# EasyEDA Pro project EDA-Robot_V1.3.epro

# Schematic EDA-Robot插件版(带开关)
Board Name: V1.3; Create Date: 2024-12-31; Page Name: P1; Project Name: EDA-Robot机器狗; Schematic Name: EDA-Robot插件版(带开关); Update Date: 2025-01-21; Company: 嘉立创EDA; Page Size: A4; Version: V1.0
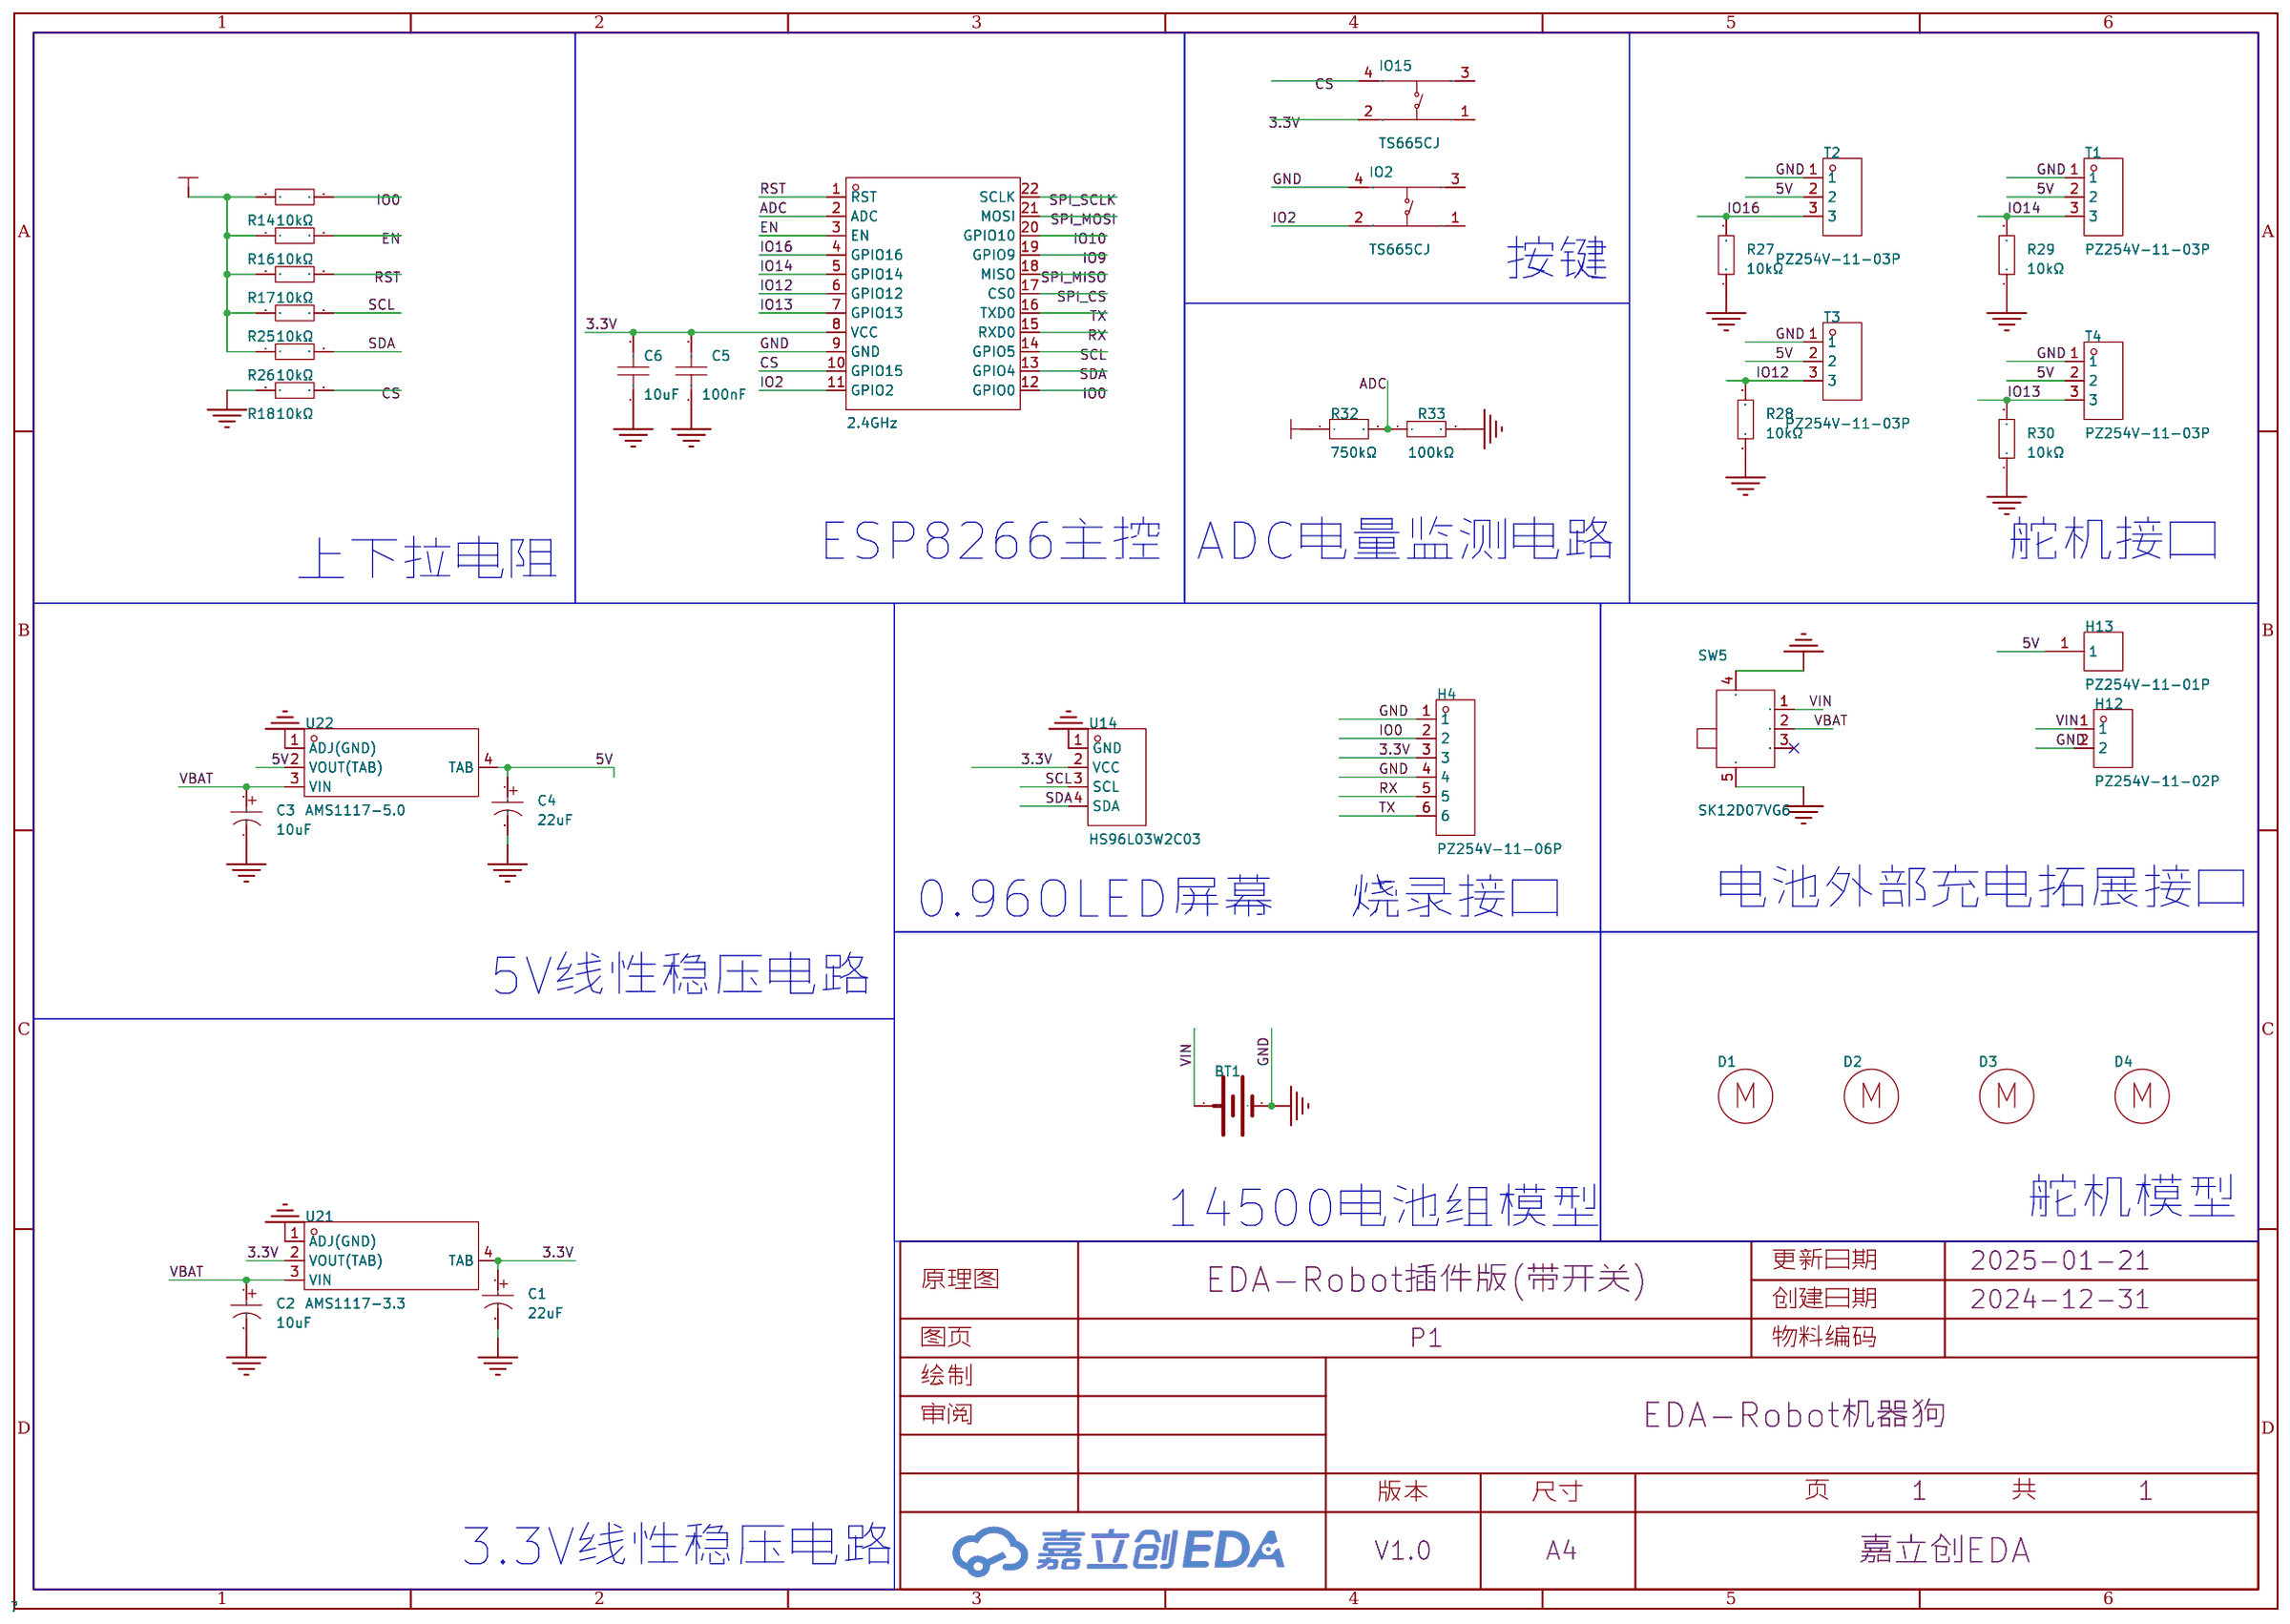
[diagram p0: schematic sheet]

## Parts
BT1  -  [2节串联14500电池盒]
C1  22uF  [CAP-TH_BD4.0-P1.50-D0.8-FD]
C2  10uF  [CAP-TH_BD4.0-P1.50-D0.8-FD]
C3  10uF  [CAP-TH_BD4.0-P1.50-D0.8-FD]
C4  22uF  [CAP-TH_BD4.0-P1.50-D0.8-FD]
C5  100nF  [CAP-TH_L4.2-W3.5-P2.54-D0.5]
C6  10uF  [CAP-TH_L5.5-W3.8-P3.50-D0.6]
D1  -  [舵机]
D2  -  [舵机]
D3  -  [舵机]
D4  -  [舵机]
H4  PZ254V-11-06P  [HDR-TH_6P-P2.54-V-M]
H12  PZ254V-11-02P  [HDR-TH_2P-P2.54-V-M]
H13  PZ254V-11-01P  [HDR-TH_1P-P2.54-V-M]
IO2  TS665CJ  [SW-TH_4P-L6.0-W6.0-P4.50-LS6.5]
IO15  TS665CJ  [SW-TH_4P-L6.0-W6.0-P4.50-LS6.5]
R14  10kΩ  [RES-TH_BD2.4-L6.3-P10.30-D0.6]
R16  10kΩ  [RES-TH_BD2.4-L6.3-P10.30-D0.6]
R17  10kΩ  [RES-TH_BD2.4-L6.3-P10.30-D0.6]
R18  10kΩ  [RES-TH_BD2.4-L6.3-P10.30-D0.6]
R25  10kΩ  [RES-TH_BD2.4-L6.3-P10.30-D0.6]
R26  10kΩ  [RES-TH_BD2.4-L6.3-P10.30-D0.6]
R27  10kΩ  [RES-TH_BD2.4-L6.3-P10.30-D0.6]
R28  10kΩ  [RES-TH_BD2.4-L6.3-P10.30-D0.6]
R29  10kΩ  [RES-TH_BD2.4-L6.3-P10.30-D0.6]
R30  10kΩ  [RES-TH_BD2.4-L6.3-P10.30-D0.6]
R32  750kΩ  [RES-TH_BD2.4-L6.3-P10.30-D0.6]
R33  100kΩ  [RES-TH_BD2.4-L6.3-P10.30-D0.6]
SW5  SK12D07VG6  [SW-TH_SK12D07VG6]
T1  PZ254V-11-03P  [HDR-TH_3P-P2.54-V-M]
T2  PZ254V-11-03P  [HDR-TH_3P-P2.54-V-M]
T3  PZ254V-11-03P  [HDR-TH_3P-P2.54-V-M]
T4  PZ254V-11-03P  [HDR-TH_3P-P2.54-V-M]
U10  2.4GHz  [WIFIM-SMD_ESP-12F-ESP8266MOD]
U14  HS96L03W2C03  [OLED-TH_L27.8-W27.2-P2.54_C9900033791]
U21  AMS1117-3.3  [SOT-223-4_L6.5-W3.5-P2.30-LS7.0-BR]
U22  AMS1117-5.0  [SOT-223_L6.7-W3.5-P2.30-BR]

## Library data of the parts
BT1 = 2节串联14500电池组: 连接器类型:电池底座;适用电池规格:CR1220;触头材质:磷青铜;工作温度范围:-25℃~+85℃;; JLCPCB Part Class: 扩展库
C1 C4 = KS226M025C07RR0VH2FP0: 容值:22uF;精度:±20%;额定电压:25V;纹波电流:-;等效串联电阻:-;; LCSC Part Name: 22uF ±20% 25V; Supplier Part: C43840; Manufacturer: CX(承兴); Supplier Footprint: 插件,D4xL7mm; JLCPCB Part Class: Extended Part; Datasheet: https://atta.szlcsc.com/upload/public/pdf/source/20211027/7B10195EF01EB9374BE8935690E3D906.pdf; Supplier: LCSC; Tolerance: ±20%; Rated Voltage: 25V; Lead Spacing: 1.5mm; φD: 4mm; L: 7mm; Lifetime @ Temp: 1000hrs@105℃; Operating Temperature: -40℃~+105℃
C2 C3 = KS106M025C07RR0VH2FP0: 容值:10uF;精度:±20%;额定电压:25V;纹波电流:29mA@120Hz;等效串联电阻:-;; LCSC Part Name: 10uF ±20% 25V; Supplier Part: C43351; Manufacturer: CX(承兴); Supplier Footprint: 插件,D4xL7mm; JLCPCB Part Class: 扩展库; Datasheet: https://atta.szlcsc.com/upload/public/pdf/source/20211027/7B10195EF01EB9374BE8935690E3D906.pdf; Supplier: LCSC; Tolerance: ±20%; Rated Voltage: 25V; Ripple Current: 29mA@120Hz; Lead Spacing: 1.5mm; φD: 4mm; L: 7mm; Lifetime @ Temp: 1000hrs@105℃; Operating Temperature: -40℃~+105℃
C5 = 178MU0006: 容值:100nF;精度:±10%;额定电压:50V;温度系数:X7R;; LCSC Part Name: 100nF ±10% 50V; Supplier Part: C5632430; Manufacturer: KNSCHA(科尼盛); Supplier Footprint: 插件,P=2.54mm; JLCPCB Part Class: 扩展库; Datasheet: https://atta.szlcsc.com/upload/public/pdf/source/20230506/6B3136079A6D587E863927628E877AC6.pdf; Supplier: LCSC; Tolerance: ±10%; Voltage Rated: 50V; Temperature Coefficient: X7R
C6 = CD1E106MC9BER2F100: 容值:10uF;精度:±20%;额定电压:25V;温度系数:X5R;; LCSC Part Name: 10uF ±20% 25V; Supplier Part: C2761733; Manufacturer: Dersonic(德尔创); Supplier Footprint: 插件,P=5.08mm; JLCPCB Part Class: 扩展库; Datasheet: https://atta.szlcsc.com/upload/public/pdf/source/20210512/C2761733_48A4F8FFA54EF14BEC181E01EC41507A.pdf; Supplier: LCSC; Tolerance: ±20%; Voltage Rated: 25V; Temperature Coefficient: X5R
D1-D4 = SG90舵机(180度版): JLCPCB Part Class: 扩展库
H4 = PZ254V-11-06P: 插针结构:1x6P;间距:2.54mm;行距:-;圆针/方针:方针;安装类型:直插;排数:单排;总PIN位数:6P;额定电流:-;额定电压:-;配合针长度:6mm;塑高:2.5mm;端接针长度:3mm;触头材质:黄铜;触头镀层:-;工作温度范围:-40℃~+105℃;颜色:黑色;; LCSC Part Name: 间距:2.54mm 1x6P 直插 方针; Supplier Part: C492405; Manufacturer: XFCN(兴飞); Supplier Footprint: 插件,P=2.54mm; JLCPCB Part Class: 扩展库; Datasheet: https://atta.szlcsc.com/upload/public/pdf/source/20200309/C492405_597F1930F5B55CC3C7FD95458F1C3977.pdf; Supplier: LCSC; Pin Structure: 1x6P; Pitch: 2.54mm; Circluar Pins/Square Pins: 方针; Mounting Type: 直插; Number of Rows: 单排; Number of Pins: 6P; Length of Mating Pin: 6mm; Insulation Height: 2.5mm; Length of End Connection Pin: 3mm; Contact Material: 黄铜; Operating Temperature Range: -40℃~+105℃; Color: 黑色
H12 = PZ254V-11-02P: 插针结构:1x2P;间距:2.54mm;行距:-;圆针/方针:方针;安装类型:直插;排数:单排;总PIN位数:2P;额定电流:-;额定电压:-;配合针长度:6mm;塑高:2.5mm;端接针长度:3mm;触头材质:黄铜;触头镀层:-;工作温度范围:-40℃~+105℃;颜色:黑色;; LCSC Part Name: 间距:2.54mm 1x2P 直插 方针; Supplier Part: C492401; Manufacturer: XFCN(兴飞); Supplier Footprint: 插件,P=2.54mm; JLCPCB Part Class: 扩展库; Datasheet: https://atta.szlcsc.com/upload/public/pdf/source/20200309/C492401_A812433581A9B211A7FFA413ADDFF0E5.pdf; Supplier: LCSC; Pin Structure: 1x2P; Pitch: 2.54mm; Circluar Pins/Square Pins: 方针; Mounting Type: 直插; Number of Rows: 单排; Number of Pins: 2P; Length of Mating Pin: 6mm; Insulation Height: 2.5mm; Length of End Connection Pin: 3mm; Contact Material: 黄铜; Operating Temperature Range: -40℃~+105℃; Color: 黑色
H13 = PZ254V-11-01P: 插针结构:1x1P;间距:2.54mm;行距:-;圆针/方针:方针;安装类型:直插;排数:单排;总PIN位数:1P;额定电流:-;额定电压:-;配合针长度:6mm;塑高:2.5mm;端接针长度:3mm;触头材质:黄铜;触头镀层:-;工作温度范围:-40℃~+105℃;颜色:黑色;; LCSC Part Name: 间距:2.54mm 1x1P 直插 方针; Supplier Part: C492400; Manufacturer: XFCN(兴飞); Supplier Footprint: 插件,P=2.54mm; JLCPCB Part Class: 扩展库; Datasheet: https://atta.szlcsc.com/upload/public/pdf/source/20200309/C492400_46876A5B545F5AE6B8D4A09C46E276E8.pdf; Supplier: LCSC; Pin Structure: 1x1P; Pitch: 2.54mm; Circluar Pins/Square Pins: 方针; Mounting Type: 直插; Number of Rows: 单排; Number of Pins: 1P; Length of Mating Pin: 6mm; Insulation Height: 2.5mm; Length of End Connection Pin: 3mm; Contact Material: 黄铜; Operating Temperature Range: -40℃~+105℃; Color: 黑色
IO2 IO15 = TS665CJ: 电路结构:单刀单掷;按钮形状:圆形按钮;安装方式:直插;开关长度:6mm;开关宽度:6mm;开关高度:5mm;触点电流:50mA;额定电压(DC):12V;带灯:-;机械寿命:-;; LCSC Part Name: 6*6*5mm 直插 轻触开关; Supplier Part: C393938; Manufacturer: SHOU HAN(首韩); Supplier Footprint: 插件; JLCPCB Part Class: 扩展库; Datasheet: https://atta.szlcsc.com/upload/public/pdf/source/20190521/C393938_BDABEAC600B4C55E200A80AA129B70BC.pdf; Supplier: LCSC; Circuit: 单刀单掷; Actuator Style: 圆形按钮; Mounting Style: 直插; Switch Length: 6mm; Switch Width: 6mm; Switch Height: 5mm; Contact Current: 50mA; Voltage Rating (DC): 12V
R14 R16-R18 R25-R30 = RN1/4W10KFT/BA1: 电阻类型:金属膜电阻;阻值:10kΩ;精度:±1%;功率:250mW;温度系数:±50ppm/℃;; LCSC Part Name: 10kΩ ±1% 250mW 金属膜电阻; Supplier Part: C410695; Manufacturer: Tyohm(幸亚电阻); Supplier Footprint: 插件,D2.4xL6.5mm; JLCPCB Part Class: Extended Part; Datasheet: https://atta.szlcsc.com/upload/public/pdf/source/20190808/C410699_D126E64D28B638F1D73B58E9F61DFD9B.pdf; Supplier: LCSC; Type: 金属膜电阻; Tolerance: ±1%; Overload Voltage (Max): 250V; Power(Watts): 250mW; Temperature Coefficient: ±50ppm/℃; Operating Temperature Range: -55℃~+125℃
R32 = MFR-25FTE52-750K: 电阻类型:金属膜电阻;阻值:750kΩ;精度:±1%;功率:250mW;温度系数:±50ppm/℃;; LCSC Part Name: 金属膜电阻 750kΩ ±1% 250mW; Supplier Part: C173043; Manufacturer: YAGEO(国巨); Supplier Footprint: 插件,D2.4xL6.3mm; JLCPCB Part Class: Extended Part; Datasheet: https://atta.szlcsc.com/upload/public/pdf/source/20191118/C457825_18355E864DE4965678DC27B0EBC3E21E.pdf; Supplier: LCSC; Type: 金属膜电阻; Tolerance: ±1%; Power(Watts): 250mW; Temperature Coefficient: ±50ppm/℃; Operating Temperature Range: -55℃~+155℃
R33 = MFR50SFTE52-100K: 电阻类型:金属膜电阻;阻值:100kΩ;精度:±1%;功率:500mW;温度系数:±50ppm/℃;; LCSC Part Name: 金属膜电阻 100kΩ ±1% 500mW; Supplier Part: C173137; Manufacturer: YAGEO(国巨); Supplier Footprint: 插件,D2.4xL6.3mm; JLCPCB Part Class: Extended Part; Datasheet: https://atta.szlcsc.com/upload/public/pdf/source/20191118/C457825_18355E864DE4965678DC27B0EBC3E21E.pdf; Supplier: LCSC; Type: 金属膜电阻; Tolerance: ±1%; Power(Watts): 500mW; Temperature Coefficient: ±50ppm/℃; Operating Temperature Range: -55℃~+155℃
SW5 = SK12D07VG6: 电路结构:单刀双掷;安装方式:-;开关颜色:-;额定电流(DC):500mA;额定电压(DC):50V;额定电流(AC):-;额定电压(AC):-;机械寿命:5千次;; LCSC Part Name: 3脚2两档位SK12D07VG6 1P2T卧式拨动开关,柄长6MM; Supplier Part: C2681575; Manufacturer: SHOU HAN(首韩); Supplier Footprint: 插件; JLCPCB Part Class: 扩展库; Datasheet: https://atta.szlcsc.com/upload/public/pdf/source/20210224/C2681575_3012D31310882582C75C81102188B09E.pdf; Supplier: LCSC; Circuit: 单刀双掷; Pin Style: PC引脚; Switch Length: 8.7mm; Switch Width: 4.4mm; Switch Height: 4.7mm; Current Rating (DC): 500mA; Voltage Rating (DC): 50V; Mechanical Life: 5千次; Operating Temperature: -10℃~+50℃
T1-T4 = PZ254V-11-03P: 插针结构:1x3P;间距:2.54mm;行距:-;圆针/方针:方针;安装类型:直插;排数:单排;总PIN位数:3P;额定电流:3A;额定电压:250V;配合针长度:6mm;塑高:2.5mm;端接针长度:3mm;工作温度范围:-40℃~+105℃;颜色:黑色;; LCSC Part Name: 间距:2.54mm 1x3P 直插 方针; Supplier Part: C2937625; Manufacturer: XFCN(兴飞); Supplier Footprint: 插件,P=2.54mm; JLCPCB Part Class: 扩展库; Datasheet: https://atta.szlcsc.com/upload/public/pdf/source/20200309/C492402_8335C3D49C4E4C618838D59BB1D024C1.pdf; Supplier: LCSC; Pin Structure: 1x3P; Pitch: 2.54mm; Circluar Pins/Square Pins: 方针; Mounting Type: 直插; Number of Rows: 单排; Number of Pins: 3P; Current Rating (Max): 3A; Voltage Rating (Max): 250V; Length of Mating Pin: 6mm; Insulation Height: 2.5mm; Length of End Connection Pin: 3mm; Operating Temperature Range: -40℃~+105℃; Color: 黑色
U10 = ESP-12F(ESP8266MOD): 频率:2.4GHz;发射功率:16dBm;核心处理器:ESP8266;天线形式:PCB 板载天线;接收灵敏度:-90dBm;; LCSC Part Name: 完整的802.11b/g/n Wi-Fi的SoC模块; Supplier Part: C82891; Manufacturer: Ai-Thinker(安信可); Supplier Footprint: SMD,16x24mm; JLCPCB Part Class: Extended Part; Datasheet: https://atta.szlcsc.com/upload/public/pdf/source/20210219/C82891_ABD84A460F4F056A2757267CCCA4B508.pdf; Supplier: LCSC; Output Power: 16dBm; Core Processor: ESP8266; Support Interface: GPIO；UART；I2C；PWM；SPI；ADC; Antenna Type: PCB 板载天线; Wireless Standard: 802.11b/g/n; Operating Voltage: 3.3V; Receive  Current: 120mA; Send  Current: 170mA; Sensitivity: -90dBm; Operating Temperature: -40℃~+85℃
U14 = HS96L03W2C03: 主控芯片:SSD1315;接口类型:I2C;尺寸(inch):0.96;像素分辨率:128x64;; LCSC Part Name: 0.96寸OLED显示屏窄白光IIC; Supplier Part: C5248080; Manufacturer: HS(汉昇); JLCPCB Part Class: 扩展库; Datasheet: https://atta.szlcsc.com/upload/public/pdf/source/20230627/763D01F79A90007632F098068C7C8AD9.pdf; Supplier: LCSC; Main Control Chip: SSD1315; Interface Type: I2C; Size: 0.96; Pixel Resolution: 128x64; Operating Temperature: -40℃~+70℃
U21 = AMS1117-3.3_C347222: 输出类型:固定;最大输入电压:18V;输出电压:3.3V;输出电流:1A;电源纹波抑制比(PSRR):60dB@(120Hz);输出极性:正极;; LCSC Part Name: 输出:3.3V 电流:1A 耐压:12V; Supplier Part: C347222; Manufacturer: UMW(友台半导体); Supplier Footprint: SOT-223; JLCPCB Part Class: 扩展库; Datasheet: https://atta.szlcsc.com/upload/public/pdf/source/20231109/155D79A26D9DB04352555A58D5969DC8.pdf; Supplier: LCSC; Output Type: 固定; Maximum Input Voltage: 18V; Output Voltage: 3.3V; Output Current: 1A; Power Supply Rejection Ratio (PSRR): 60dB@(120Hz); Dropout Voltage: 1.3V@(1A); Feature: 过流保护(OCP); Output Polarity: 正极; Number of Outputs: 1
U22 = AMS1117-5.0_C347223: 输出类型:固定;最大输入电压:12V;输出电压:5V;最大输出电流:1A;电源纹波抑制比(PSRR):60dB@(120Hz);输出极性:正极;; LCSC Part Name: 输出:5V 电流:1A 耐压:12V; Supplier Part: C347223; Manufacturer: UMW(友台半导体); Supplier Footprint: SOT-223; JLCPCB Part Class: 扩展库; Datasheet: https://atta.szlcsc.com/upload/public/pdf/source/20231109/155D79A26D9DB04352555A58D5969DC8.pdf; Supplier: LCSC; Output Type: 固定; Maximum Input Voltage: 12V; Output Voltage: 5V; MAX Output Current: 1A; Power Supply Rejection Ratio (PSRR): 60dB@(120Hz); Dropout Voltage: 1.3V@(1A); Output Polarity: 正极; Number of Outputs: 1

## Nets
3.3V: C1.1 C5.2 C6.2 H4.3 IO15.2(B) R14.1 R16.1 R17.1 R25.1 R26.1 U10.8(VCC) U14.2(VCC) U21.2(VOUT(TAB)) U21.4(TAB)
5V: C4.1 H13.1 T1.2 T2.2 T3.2 T4.2 U22.2(VOUT(TAB)) U22.4(TAB)
GND: BT1.2(-) C1.2 C2.2 C3.2 C4.2 C5.1 C6.1 H4.1 H4.4 H12.2 IO2.4(D) R18.1 R27.1 R28.1 R29.1 R30.1 R33.2 SW5.4 SW5.5 T1.1 T2.1 T3.1 T4.1 U10.9(GND) U14.1(GND) U21.1(ADJ(GND)) U22.1(ADJ(GND))
VBAT: C2.1 C3.1 R32.1 SW5.2 U21.3(VIN) U22.3(VIN)
VIN: BT1.1(+) H12.1 SW5.1
ADC: R32.2 R33.1 U10.2(ADC)
CS: IO15.4(D) R18.2 U10.10(GPIO15)
EN: R16.2 U10.3(EN)
IO0: H4.2 R14.2 U10.12(GPIO0)
IO2: IO2.2(B) U10.11(GPIO2)
IO9: U10.19(GPIO9)
IO10: U10.20(GPIO10)
IO12: R28.2 T3.3 U10.6(GPIO12)
IO13: R30.2 T4.3 U10.7(GPIO13)
IO14: R29.2 T1.3 U10.5(GPIO14)
IO16: R27.2 T2.3 U10.4(GPIO16)
RST: R17.2 U10.1(RST)
RX: H4.5 U10.15(RXD0)
SCL: R25.2 U10.14(GPIO5) U14.3(SCL)
SDA: R26.2 U10.13(GPIO4) U14.4(SDA)
SPI_CS: U10.17(CS0)
SPI_MISO: U10.18(MISO)
SPI_MOSI: U10.21(MOSI)
SPI_SCLK: U10.22(SCLK)
TX: H4.6 U10.16(TXD0)

Not connected (* = marked no-connect by the designer): IO2 1(A) 3(C); IO15 1(A) 3(C); SW5 3*

## Notes on the sheet
- 按键
- ESP8266主控
- ADC电量监测电路
- 舵机接口
- 上下拉电阻
- 电池外部充电拓展接口
- 0.96OLED屏幕
- 烧录接口
- 5V线性稳压电路
- 14500电池组模型
- 舵机模型
- 3.3V线性稳压电路

# Board PCB2_1
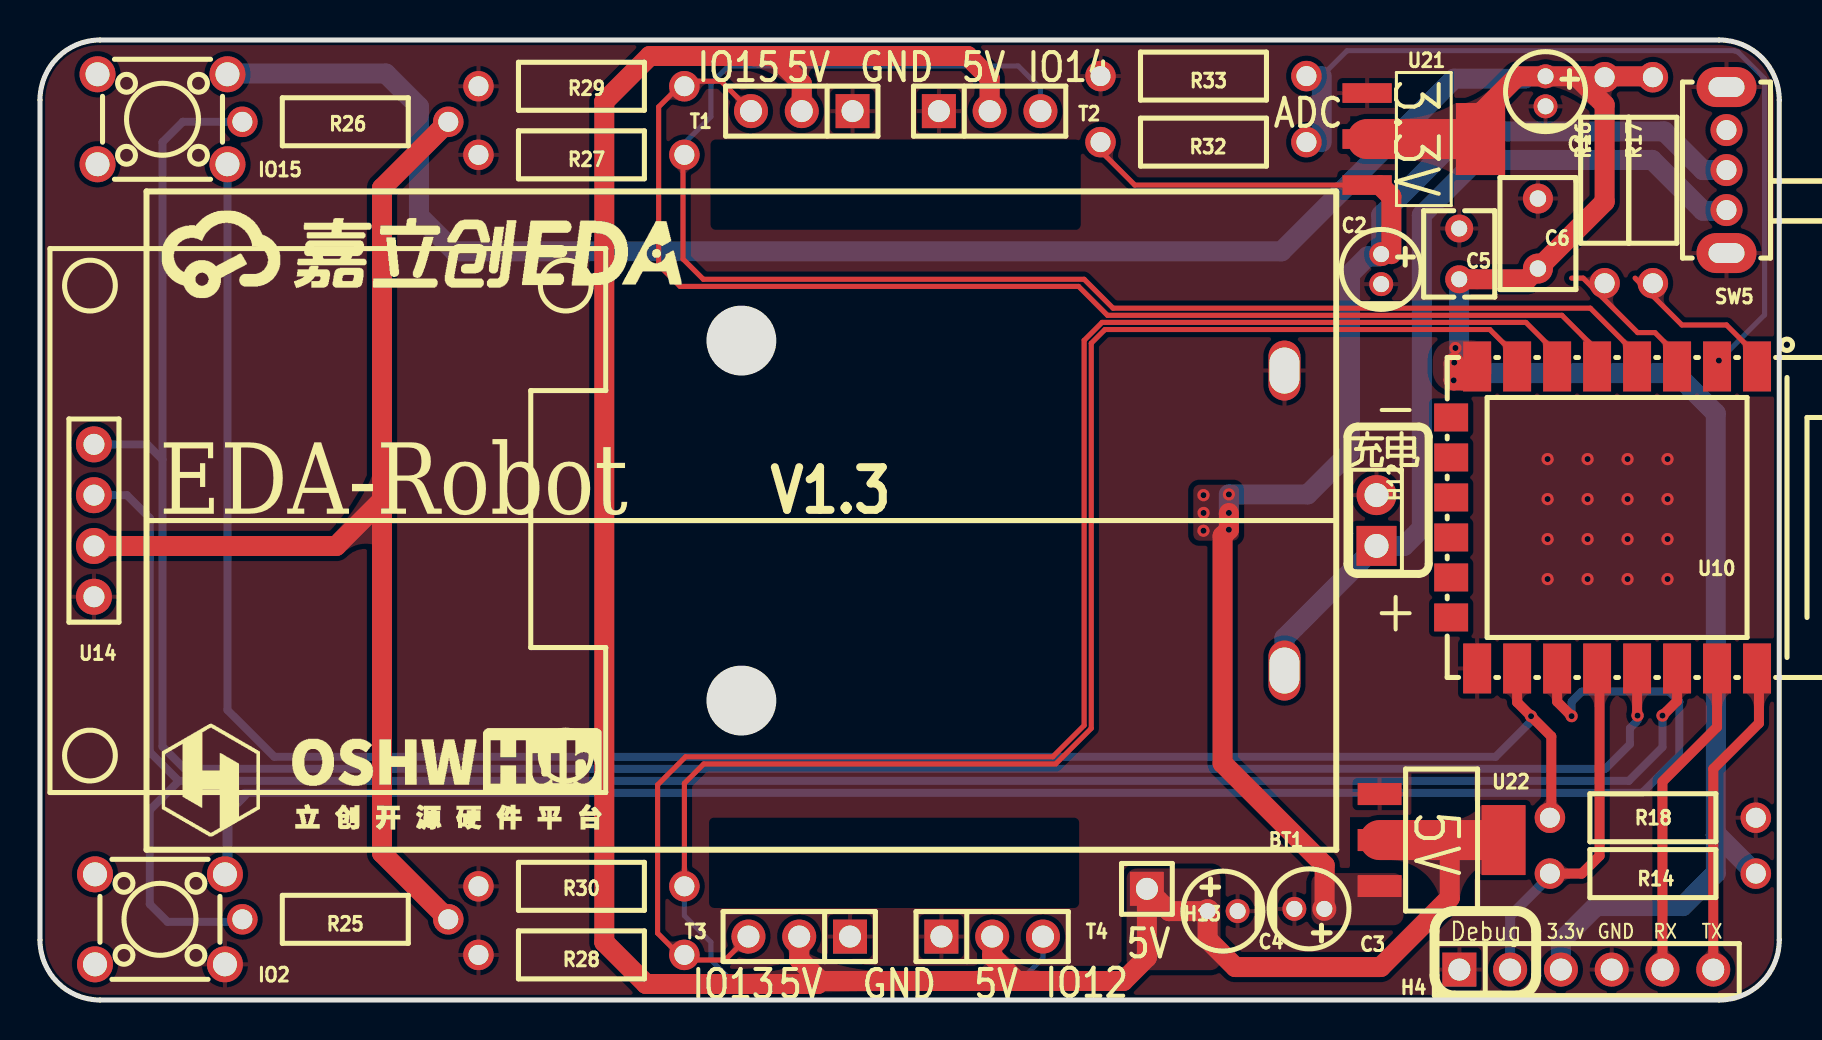
[diagram p1: board, top side]
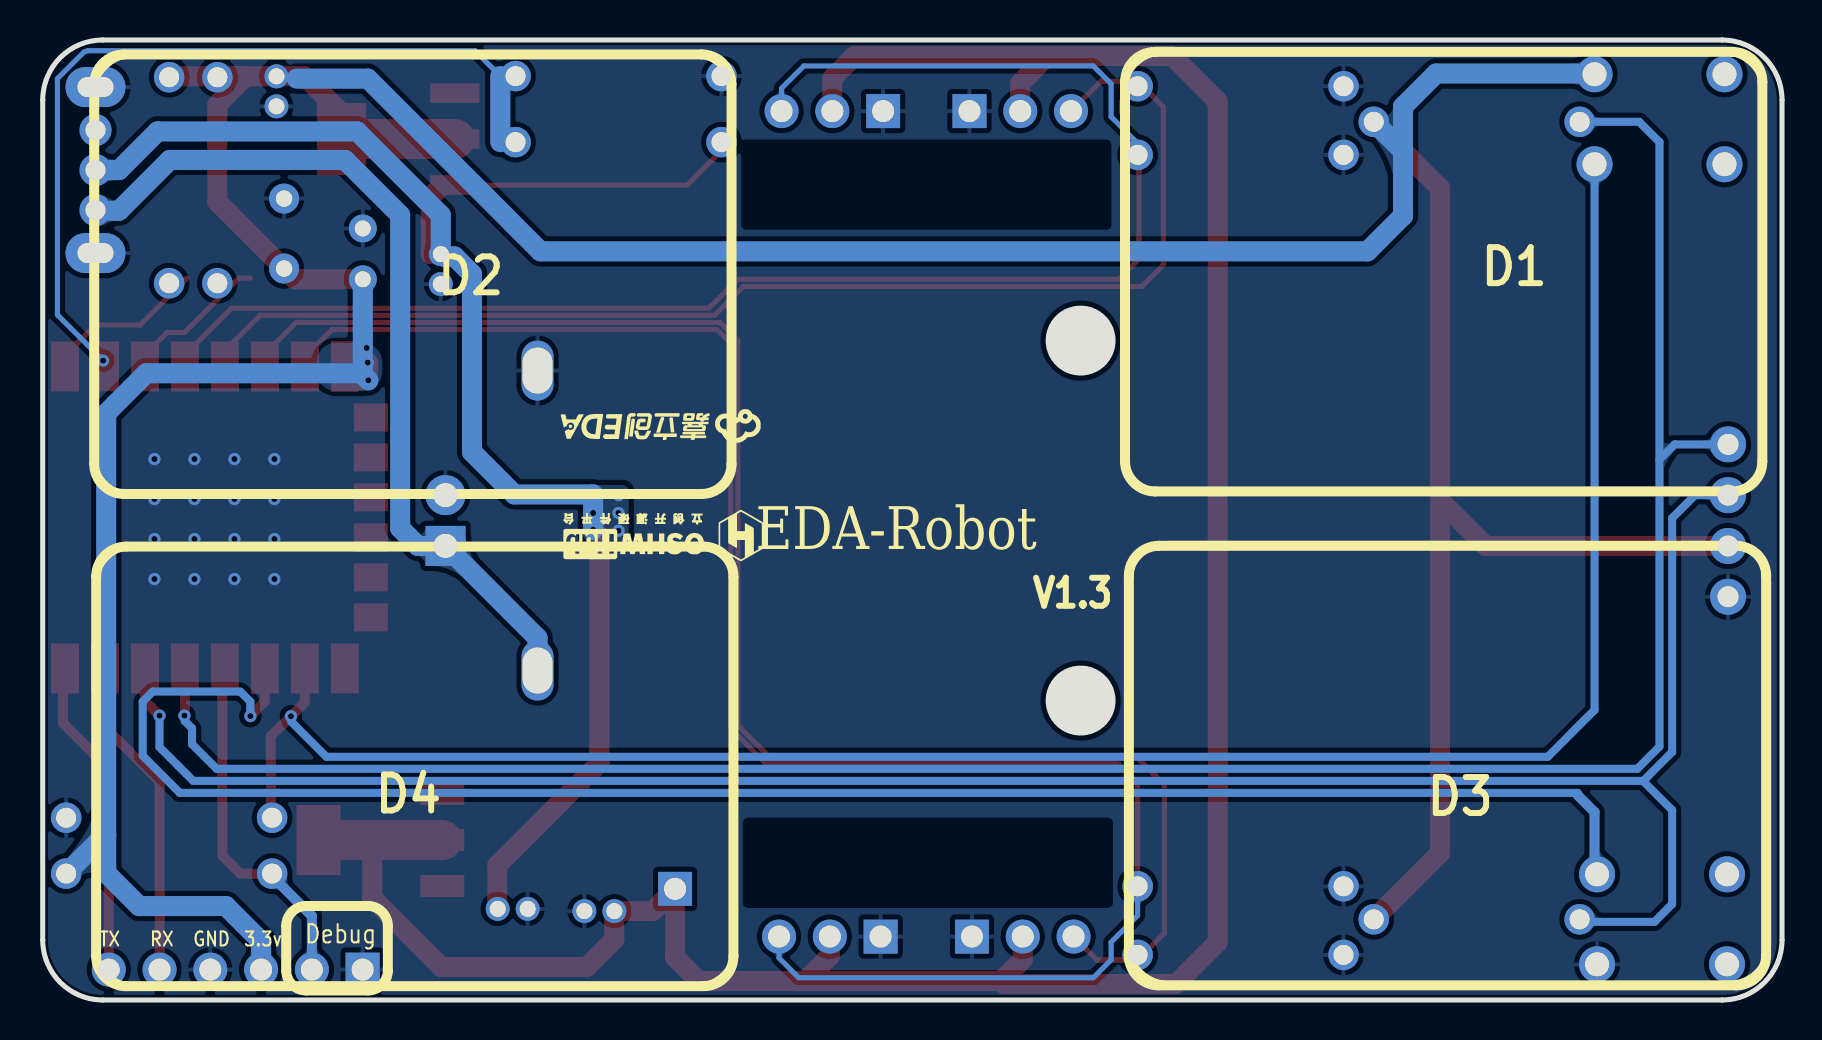
[diagram p2: board, bottom side, seen from below]

Outline 87 x 48 mm; copper layers: Top Layer, Bottom Layer. Coordinates in mm from the lower left corner of the outline.
Outline path: 0,45 0,3 arc(0.88,0.88) 3,0 84,0 arc(86.12,0.88) 87,3 87,45 arc(86.12,47.12) 84,48 3,48 arc(0.88,47.12) 0,45
Stack: Top Layer 0.035mm / Dielectric1 1.51mm FR4 er 4.5 / Bottom Layer 0.035mm

## Design rules (mm)
template: JLCPCB Capability(Two Layers Board)
spacing copperThickness1oz (default): track to track 0.102, other pairs 0.152 to 0.3
spacing copperThickness2oz: track to track 0.203, other pairs 0.152 to 0.3
track width copperThickness1oz (default): min 0.127, default 0.254, max 2.54
track width copperThickness2oz: min 0.203, default 0.254, max 2.54
differential pair differentialPair (default): width min 0.127, default 0.254, max 2.54; gap min 0.152, default 0.152
via viaSize (default): diameter min 0.5, default 0.61, max 10; hole min 0.3, default 0.305, max 6.3

## Placement (name value [footprint] x y rotation side)
BT1  -  [2节串联14500电池盒]  35.08 23.97 180 top
C1  22uF  [CAP-TH_BD4.0-P1.50-D0.8-FD]  75.31 45.44 270 top
C2  10uF  [CAP-TH_BD4.0-P1.50-D0.8-FD]  67.09 36.55 270 top
C3  10uF  [CAP-TH_BD4.0-P1.50-D0.8-FD]  63.49 4.56 180 top
C4  22uF  [CAP-TH_BD4.0-P1.50-D0.8-FD]  59.16 4.44 0 top
C5  100nF  [CAP-TH_L4.2-W3.5-P2.54-D0.5]  70.99 37.31 270 top
C6  10uF  [CAP-TH_L5.5-W3.8-P3.50-D0.6]  74.93 38.32 270 top
D1  -  [舵机]  0.79 47.47 0 bottom
D2  -  [舵机]  52.32 47.34 0 bottom
D3  -  [舵机]  32.8 0.73 180 bottom
D4  -  [舵机]  84.49 0.6 180 bottom
H4  PZ254V-11-06P  [HDR-TH_6P-P2.54-V-M]  77.35 1.52 0 top
H12  PZ254V-11-02P  [HDR-TH_2P-P2.54-V-M]  66.85 23.98 90 top
H13  PZ254V-11-01P  [HDR-TH_1P-P2.54-V-M]  55.37 5.56 0 top
IO2  TS665CJ  [SW-TH_4P-L6.0-W6.0-P4.50-LS6.5]  6 4.03 0 top
IO15  TS665CJ  [SW-TH_4P-L6.0-W6.0-P4.50-LS6.5]  6.13 44.04 0 top
R14  10kΩ  [RES-TH_BD2.4-L6.3-P10.30-D0.6]  80.68 6.32 180 top
R16  10kΩ  [RES-TH_BD2.4-L6.3-P10.30-D0.6]  78.26 40.99 270 top
R17  10kΩ  [RES-TH_BD2.4-L6.3-P10.30-D0.6]  80.68 40.99 270 top
R18  10kΩ  [RES-TH_BD2.4-L6.3-P10.30-D0.6]  80.68 9.11 180 top
R25  10kΩ  [RES-TH_BD2.4-L6.3-P10.30-D0.6]  15.27 4.03 180 top
R26  10kΩ  [RES-TH_BD2.4-L6.3-P10.30-D0.6]  15.27 43.91 180 top
R27  10kΩ  [RES-TH_BD2.4-L6.3-P10.30-D0.6]  27.08 42.26 0 top
R28  10kΩ  [RES-TH_BD2.4-L6.3-P10.30-D0.6]  27.08 2.26 0 top
R29  10kΩ  [RES-TH_BD2.4-L6.3-P10.30-D0.6]  27.08 45.69 0 top
R30  10kΩ  [RES-TH_BD2.4-L6.3-P10.30-D0.6]  27.08 5.69 0 top
R32  750kΩ  [RES-TH_BD2.4-L6.3-P10.30-D0.6]  58.2 42.9 0 top
R33  100kΩ  [RES-TH_BD2.4-L6.3-P10.30-D0.6]  58.2 46.2 180 top
SW5  SK12D07VG6  [SW-TH_SK12D07VG6]  84.36 41.5 90 top
T1  PZ254V-11-03P  [HDR-TH_3P-P2.54-V-M]  38.11 44.45 180 top
T2  PZ254V-11-03P  [HDR-TH_3P-P2.54-V-M]  47.5 44.45 0 top
T3  PZ254V-11-03P  [HDR-TH_3P-P2.54-V-M]  37.98 3.17 180 top
T4  PZ254V-11-03P  [HDR-TH_3P-P2.54-V-M]  47.63 3.17 0 top
U10  2.4GHz  [WIFIM-SMD_ESP-12F-ESP8266MOD]  78.24 24.13 180 top
U14  HS96L03W2C03  [OLED-TH_L27.8-W27.2-P2.54_C9900033791]  2.7 23.97 90 top
U21  AMS1117-3.3  [SOT-223-4_L6.5-W3.5-P2.30-LS7.0-BR]  69.22 43.05 180 top
U22  AMS1117-5.0  [SOT-223_L6.7-W3.5-P2.30-BR]  70.11 8 180 top

## Footprints (pads in the part's own frame, mm; a bottom-side part is the same pattern mirrored in y, then rotated)
2节串联14500电池盒
  oval 1.6x3 hole 1.5x2.3: 1(-27.165,7.5) 2(-27.165,-7.5)
CAP-TH_BD4.0-P1.50-D0.8-FD
  round 1.2 hole 0.8: 1(-0.75,0) 2(0.75,0)
CAP-TH_L4.2-W3.5-P2.54-D0.5
  round 1.4 hole 0.8: 1(-1.27,0) 2(1.27,0)
CAP-TH_L5.5-W3.8-P3.50-D0.6
  round 1.5 hole 0.82: 1(-1.75,0) 2(1.75,0)
HDR-TH_1P-P2.54-V-M
  rect 1.7x1.7 hole 1.1: 1(0,0)
HDR-TH_2P-P2.54-V-M
  rect 2x2 hole 1.2: 1(-1.27,0)
  round 2 hole 1.2: 2(1.27,0)
HDR-TH_3P-P2.54-V-M
  rect 1.7x1.7 hole 1.1: 1(-2.54,0)
  round 1.7 hole 1.1: 2(0,0) 3(2.54,0)
HDR-TH_6P-P2.54-V-M
  rect 1.7x1.7 hole 1.1: 1(-6.35,0)
  round 1.7 hole 1.1: 2(-3.81,0) 3(-1.27,0) 4(1.27,0) 5(3.81,0) 6(6.35,0)
OLED-TH_L27.8-W27.2-P2.54_C9900033791
  round 1.8 hole 1.05: 1(-3.81,0) 2(-1.27,0) 3(1.27,0) 4(3.81,0)
RES-TH_BD2.4-L6.3-P10.30-D0.6
  round 1.524 hole 1: 1(-5.15,0) 2(5.15,0)
SOT-223-4_L6.5-W3.5-P2.30-LS7.0-BR
  rect 2.47x0.98 smd: 1(2.835,-2.3) 2(2.835,0) 3(2.835,2.3)
  rect 2.47x3.6 smd: 4(-2.835,0)
SOT-223_L6.7-W3.5-P2.30-BR
  rect 2.2x1.1 smd: 1(3.099,-2.3) 2(3.099,0) 3(3.099,2.3)
  rect 2.2x3.5 smd: 4(-3.099,0)
SW-TH_4P-L6.0-W6.0-P4.50-LS6.5
  round 1.8 hole 1.2: 1(-3.25,2.25) 2(3.25,2.25) 3(-3.25,-2.25) 4(3.25,-2.25)
SW-TH_SK12D07VG6
  oval 1.6x1.6 hole 1: 1(-2,0) 2(0,0) 3(2,0)
  oval 2x3 hole 1x1.8: 4(4.15,0) 5(-4.15,0)
WIFIM-SMD_ESP-12F-ESP8266MOD
  rect 1.4x2.5 smd: 1(-7.651,-7.551) 2(-5.651,-7.551) 3(-3.651,-7.551) 4(-1.651,-7.551) 5(0.349,-7.551) 6(2.349,-7.551) 7(4.349,-7.551) 8(6.349,-7.551) 9(6.349,7.548) 10(4.349,7.55) 11(2.349,7.551) 12(0.349,7.551) 13(-1.651,7.55) 14(-3.651,7.551) 15(-5.651,7.551) 16(-7.651,7.551)
  rect 1.7x1.4 smd: 17(7.651,-5) 18(7.649,-3.002) 19(7.649,-1.004) 20(7.649,0.998) 21(7.649,2.997) 22(7.651,4.997)

## Nets
As in the schematic.

Pads without a net: IO2 1 3; IO15 1 3; SW5 3

## Via types
v1: diameter 0.61, hole 0.305, Top Layer to Bottom Layer, 30 vias

## Routing (per net, layer and track width the routed paths; a pad name or vN(x,y) marks a point on that pad's centre or on a via; arc(x,y) is an arc through that point)
3.3V: length 225.2
  Top Layer w1: 76.84,46.19 77.23,46.19 ; 76.84,46.19 C1.1 73.89,46.19 72.17,44.46 72.17,43.17 U21.4 ; 76.84,46.19 78.26,44.77 78.26,39.91 C6.2 74.39,36.04 C5.2 ; 77.23,46.19 77.34,46.07 ; 77.23,46.19 80.63,46.19 R17.1 ; 17.11,24.99 17.11,40.6 R26.1 ; 17.11,24.99 17.11,7.35 R25.1 ; 17.11,24.99 14.82,22.7 U14.2 ; v1(70.74,31.87) 70.71,31.84 v1(70.71,30.98) 71.2,30.98 71.89,31.68
  Top Layer w2: 66.39,43.05 U21.4
  Bottom Layer w1: H4.3 76.08,2.94 77.84,4.7 82.17,4.7 83.83,6.35 83.83,8.24 ; 74.29,46.07 70.74,46.07 62.1,37.44 20.73,37.44 18.96,39.21 18.96,42.44 ; C5.2 70.99,31.47 ; 83.83,8.24 83.83,29.33 81.82,31.34 71.07,31.34 v1(70.71,30.98) ; 83.83,8.24 83.91,8.24 85.83,6.32 85.83,6.24 ; 18.96,42.44 R26.1 ; 18.96,42.44 18.96,44.67 17.3,46.33 9.47,46.33 9.38,46.42
  vias: v1(70.8,32.6)
5V: length 133.2
  Top Layer w1: T1.2 38.11,45.83 36.74,47.2 ; 39.06,0.95 38.91,0.8 30.32,0.8 28.23,2.89 28.23,44.93 30.5,47.2 36.74,47.2 ; 39.06,0.95 37.98,2.03 T3.2 ; 39.06,0.95 48.87,0.95 ; 36.74,47.2 46.4,47.2 47.5,46.1 T2.2 ; 70.52,8 70.52,5.11 67.06,1.65 59.79,1.65 58.41,3.03 C4.1 56.48,4.44 H13.1 55.37,2.13 54.19,0.95 48.87,0.95 ; 48.87,0.95 47.63,2.19 T4.2
  Top Layer w2: U22.2 U22.4
GND:
  vias: v1(75.41,27.05) v1(75.41,25.05) v1(75.41,23.05) v1(75.41,21.05) v1(77.41,27.05) v1(77.41,25.05) v1(77.41,23.05) v1(77.41,21.05) v1(79.41,27.05) v1(79.41,25.05) v1(79.41,23.05) v1(79.41,21.05) v1(81.41,27.05) v1(81.41,25.05) v1(81.41,23.05) v1(81.41,21.05)
VBAT: length 82.2
  Top Layer w0.254: 67.02,40.75 54.76,40.75 53.05,42.46 R32.1
  Top Layer w1: 67.6,37.3 67.6,40.17 67.02,40.75 ; v1(59.47,24.35) v1(59.47,23.52) 59.16,23.2 59.16,11.84 64.26,6.74 64.26,4.57 C3.1
  Bottom Layer w1: SW5.2 83.18,41.5 81.25,43.43 71.27,43.43 67.09,39.25 C2.1 66.97,37.18 66.41,37.18 65.53,36.3 65.53,27.4 63.41,25.28 v1(59.47,25.28) v1(59.47,24.35) v1(59.47,23.52)
  vias: v1(58.2,25.24) v1(58.2,24.35) v1(58.2,23.47)
VIN: length 43.8
  Bottom Layer w1: 84.33,39.47 83.18,39.47 80.64,42.01 71.88,42.01 69.12,39.25 69.12,23.59 68.23,22.7 66.86,22.7 H12.1 62.25,18.1 BT1.1
ADC: length 41.6
  Bottom Layer w0.254: 64.11,46.2 65.38,47.47 84.74,47.47 arc(84.84,47.44) 84.94,47.4 86.27,46.07 86.27,34.26 v1(83.98,31.97)
  Bottom Layer w1: 64.11,46.2 64.11,42.9
CS: length 102
  Top Layer w0.5: 73.89,16.58 73.89,14.89 v1(74.58,14.19) 75.6,13.18 75.6,9.17 75.65,9.11
  Bottom Layer w0.4: 9.38,41.41 9.38,14.5 11.72,12.16 72.81,12.16 74.58,13.94
EN: length 7.5
  Top Layer w0.254: 76.61,36.09 77.19,36.09 79.92,33.37 80.78,33.37 82,32.15 82,31.79 81.89,31.68
IO0: length 17.8
  Top Layer w0.5: 75.65,6.32 77.12,6.32 78.01,7.21 78.01,16.45 77.89,16.58
  Bottom Layer w0.5: H4.2 73.54,4.2 75.65,6.32
IO2: length 89.1
  Top Layer w0.5: 75.89,16.58 75.89,14.92 v1(76.61,14.19)
  Bottom Layer w0.4: v1(76.61,14.19) 76.61,14.92 77.11,15.42 81.5,15.42 82,14.92 82,12.21 80.14,10.36 10.21,10.36
  Bottom Layer w0.5: 9.38,5.9 9.38,9.4 10.21,10.23
IO12: length 80.1
  Top Layer w0.254: 75.89,31.68 75.89,32.32 74.33,33.88 53.13,33.88 52.23,32.99 52.23,13.73 50.66,12.16 32.3,12.16 30.89,10.76 30.89,3.34 32.23,2 34.27,2 T3.3
IO13: length 91.2
  Top Layer w0.254: 73.89,31.68 73.76,31.81 73.76,32.29 72.52,33.53 53.27,33.53 52.59,32.84 52.59,13.58 50.81,11.81 33.2,11.81 32.23,10.83 32.23,5.56
  Bottom Layer w0.254: T4.3 50.17,2.1 49.18,1.11 34.45,1.11 33.56,2 33.56,2.89 32.23,4.22 32.23,5.56
IO14: length 63.2
  Top Layer w0.254: 77.89,31.68 77.89,32.48 76.13,34.24 53.39,34.24 51.95,35.68 32.02,35.68 30.95,36.75 30.95,44.66 32.23,45.94 34.07,45.94 T1.3
IO16: length 78.1
  Top Layer w0.254: 32.23,42.39 32.16,42.32 32.16,37.05 33.18,36.04 52.23,36.04 53.67,34.59 77.55,34.59 79.76,32.38 79.76,31.81 79.89,31.68
  Bottom Layer w0.254: T2.3 50.04,45.59 48.93,46.71 34.45,46.71 33.56,45.82 33.56,44.17 32.23,42.84 32.23,42.39
RST: length 8.2
  Top Layer w0.254: 85.89,31.68 85.89,32.22 84.36,33.75 82.13,33.75 79.79,36.09
RX: length 16.2
  Top Layer w0.5: 83.89,16.58 83.89,13.65 81.16,10.92 H4.5
SCL: length 107.8
  Top Layer w0.5: 81.89,16.58 81.89,14.95 v1(81.16,14.22)
  Bottom Layer w0.4: U14.3 4.35,25.24 5.49,24.1 5.49,12.4 6.94,10.96 ; 6.94,10.96 79.47,10.96 81.16,12.64 81.16,13.97 ; 6.94,10.96 6.95,10.95 5.49,9.5 5.49,4.8 6.38,3.91 10.07,3.91 10.12,3.96 R25.2
SDA: length 116.5
  Top Layer w0.5: 79.89,16.58 79.89,14.24 v1(79.91,14.22)
  Bottom Layer w0.4: U14.4 5.37,27.78 6.13,27.02 ; R26.2 7.14,43.91 6.13,42.9 6.13,27.02 ; 6.13,27.02 6.13,12.67 7.24,11.56 78.3,11.56 79.53,12.79 79.53,13.59 79.91,13.97
TX: length 16
  Top Layer w0.5: H4.6 83.7,11.55 85.98,13.84 85.98,16.48 85.89,16.58

## Copper pours and planes (outline as drawn; the poured copper is in the pictures)
3.3V on Top Layer: 69.67,32.99 72.62,32.99 72.62,30.45 69.67,30.45
3.3V on Bottom Layer: 70.01,32.86 73.31,32.86 73.31,30.45 70.01,30.45
5V on Top Layer: 54.35,6.57 59.05,6.57 59.05,1.49 54.35,1.49
GND on Top Layer: 92.21,52.32 92.21,-7.37 -2.79,-7.37 -2.79,52.32
GND on Bottom Layer: 93.1,69.72 93.1,-8.77 -15.23,-8.77 -15.23,69.72
VBAT on Top Layer: 57.69,25.76 59.98,25.76 59.98,22.97 57.69,22.97
VBAT on Top Layer: 63.6,6.35 68.2,6.35 68.2,3.74 63.6,3.74
VBAT on Bottom Layer: 57.69,25.75 59.98,25.75 59.98,22.96 57.69,22.96

Small or netless copper shapes (teardrops, artwork), in the pictures only: 63 on Top Layer, 35 on Bottom Layer

## Text on the board
Bottom Silkscreen Layer: 3.3v | GND | RX | TX | Debug | V1.3 | EDA-Robot
Top Silkscreen Layer: 3.3v | GND | RX | TX | Debug | ADC | IO13 | IO15 | 5V | IO14 | IO12 | - | + | 3.3V | V1.3 | 充电 | EDA-Robot
